# EAGLE design fridge-t10 (EAGLE 6.1)
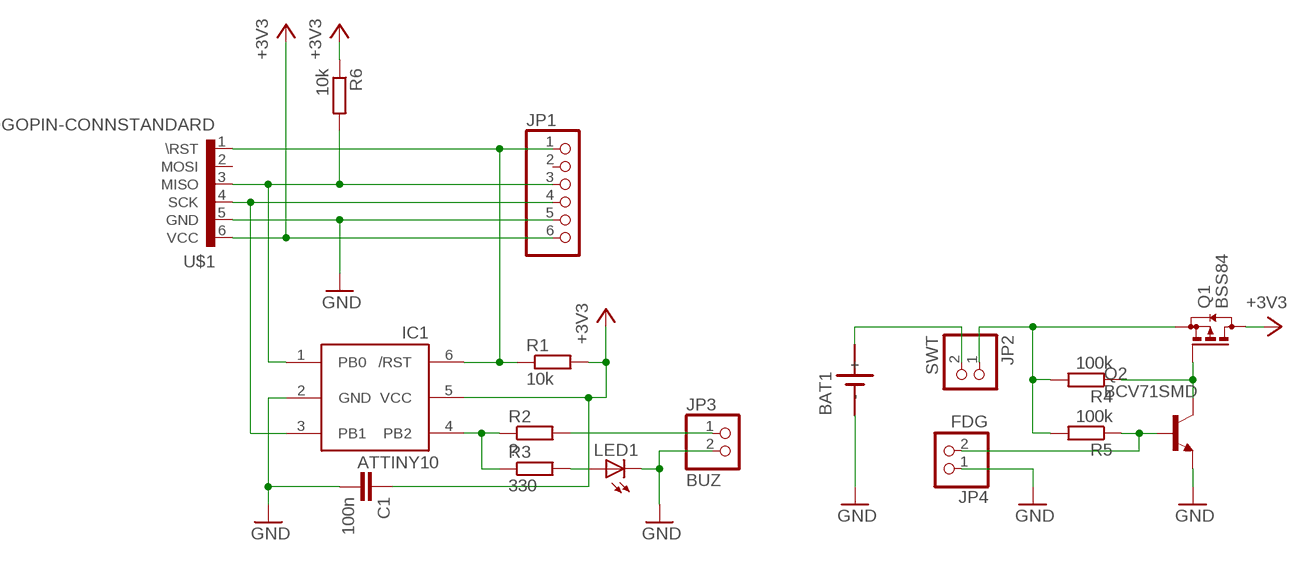
[diagram p0: schematic, sheet 1]

## Parts
BAT1  SN2032  [SN2032]
C1  100n  C-EUC0805K  [C0805K]
IC1  ATTINY10  [SOT23-6]
JP1  PINHD-1X6  [1X06]
JP2  SWT  PINHD-1X2  [1X02]
JP3  BUZ  PINHD-1X2  [1X02]
JP4  FDG  PINHD-1X2  [1X02]
LED1  LEDCHIPLED_0805  [CHIPLED_0805]
Q1  BSS84  [SOT23]
Q2  BCV71SMD  [SOT23-BEC]
R1  10k  R-EU_R0805  [R0805]
R2  ?  R-EU_R0805  [R0805]
R3  330  R-EU_R0805  [R0805]
R4  100k  R-EU_R0805  [R0805]
R5  100k  R-EU_R0805  [R0805]
R6  10k  R-EU_R0805  [R0805]
U$1  POGOPIN-CONNSTANDARD  [POGOPROG-CONN]

## Nets
+3V3: C1.1 IC1.5(VCC) JP1.6 Q1.3(D) R1.2 R6.1 U$1.6(VCC)
GND: BAT1.- C1.2 IC1.2(GND) JP1.5 JP3.2 JP4.1 LED1.C Q2.E U$1.5(GND)
N$1: BAT1.+ JP2.2
N$2: IC1.4(PB2) R2.1 R3.1
N$3: IC1.1(PB0) JP1.3 R6.2 U$1.3(MISO)
N$4: LED1.A R3.2
N$5: IC1.6(/RST) JP1.1 R1.1 U$1.1(\RST)
N$6: JP3.1 R2.2
N$7: JP2.1 Q1.2(S) R4.2 R5.2
N$8: IC1.3(PB1) JP1.4 U$1.4(SCK)
N$9: JP4.2 Q2.B R5.1
N$10: Q1.1(G) Q2.C R4.1
Unconnected: JP1.2 U$1.2(MOSI)

## Library data of the parts
BAT1 = sn2032:SN2032: LI BATTERY
C1 = rcl:C-EU: CAPACITOR, European symbol
IC1 = adafruit:ATTINY10: ATtiny4/5/9/10 8-bit Microcontroller with 512/1024 Bytes In-System Programmable Flash
JP1 = pinhead:PINHD-1X6: PIN HEADER
JP2-JP4 = pinhead:PINHD-1X2: PIN HEADER
LED1 = led:LED: LED OSRAM: - CHIPLED LG R971, LG N971, LY N971, LG Q971, LY Q971, LO R971, LY R971 LH N974, LH R974 LS Q976, LO Q976, LY Q976 LO Q996 - Hyper CHIPLED LW Q18S LB Q993, LB Q99A, LB R99A - SideLED LS A670, LO A670, LY A670, LG A670, LP A670 LB A673, LV A673, LT A673, LW A673 LH A674 LY A675 LS A676, LA A676, LO A676, LY A676, LW A676 LS A679, LY A679, LG A679 - Hyper Micro SIDELED® LS Y876, LA Y876, LO Y876, LY Y876 LT Y87S - SmartLED LW L88C, LW L88S LB L89C, LB L89S, LG L890 LS L89K, LO L89K, LY L89K LS L896, LA L896, LO L896, LY L896 - TOPLED LS T670, LO T670, LY T670, LG T670, LP T670 LSG T670, LSP T670, LSY T670, LOP T670, LYG T670 LG T671, LOG T671, LSG T671 LB T673, LV T673, LT T673, LW T673 LH T674 LS T676, LA T676, LO T676, LY T676, LB T676, LH T676, LSB T676, LW T676 LB T67C, LV T67C, LT T67C, LS T67K, LO T67K, LY T67K, LW E67C LS E67B, LA E67B, LO E67B, LY E67B, LB E67C, LV E67C, LT E67C LW T67C LS T679, LY T679, LG T679 LS T770, LO T770, LY T770, LG T770, LP T770 LB T773, LV T773, LT T773, LW T773 LH T774 LS E675, LA E675, LY E675, LS T675 LS T776, LA T776, LO T776, LY T776, LB T776 LHGB T686 LT T68C, LB T68C - Hyper Mini TOPLED® LB M676 - Mini TOPLED Santana® LG M470 LS M47K, LO M47K, LY M47K Source: http://www.osram.convergy.de LUXEON: - LUMILED® LXK2-PW12-R00, LXK2-PW12-S00, LXK2-PW14-U00, LXK2-PW14-V00 LXK2-PM12-R00, LXK2-PM12-S00, LXK2-PM14-U00 LXK2-PE12-Q00, LXK2-PE12-R00, LXK2-PE12-S00, LXK2-PE14-T00, LXK2-PE14-U00 LXK2-PB12-K00, LXK2-PB12-L00, LXK2-PB12-M00, LXK2-PB14-N00, LXK2-PB14-P00, LXK2-PB14-Q00 LXK2-PR12-L00, LXK2-PR12-M00, LXK2-PR14-Q00, LXK2-PR14-R00 LXK2-PD12-Q00, LXK2-PD12-R00, LXK2-PD12-S00 LXK2-PH12-R00, LXK2-PH12-S00 LXK2-PL12-P00, LXK2-PL12-Q00, LXK2-PL12-R00 Source: www.luxeon.com KINGBRIGHT: KA-3528ASYC Source: www.kingbright.com
Q1 = transistor-small-signal:BSS84: P-CHANNEL MOS FET
Q2 = transistor-npn:BCV71*: NPN Transistor
R1-R6 = rcl:R-EU_: RESISTOR, European symbol
U$1 = Protofusion:POGOPIN-CONN: Protofusion custom pogo pin programming header

## Board
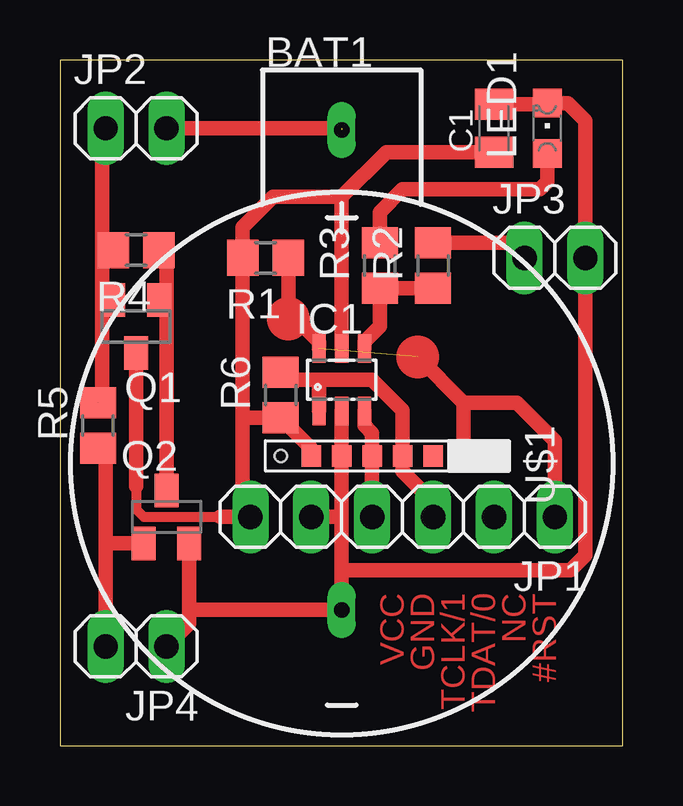
[diagram p1: board, top side]

Size 23.48 x 28.56 mm. Coordinates in mm from the lower left corner, seen from the top.
Outline: 0,0 23.48,0 23.48,28.56 0,28.56 0,0
Copper layers (1*16): Top 0.035mm / dielectric 1.5mm / Bottom 0.035mm
Design rules: minimum track width 10mil, minimum drill 24mil, track to track 12mil, track to pad 12mil, pad to pad 12mil, via to via 12mil, smd to smd 10mil, copper to edge 12mil, drill to drill 12mil, minimum pad ring 10mil, minimum via ring 10mil, stop-mask expansion 4mil, vias tented up to drill 0mil, thermal gap 12mil

### Footprints (pad centres in the part's own frame; a part is rotated, then mirrored left to right if it is on the bottom)
SN2032 = drill 0.65 long: + 0,13.9; - 0,-6.1
C0805K = smd 1.3 x 1.6: 1 -1,0; 2 1,0
SOT23-6 = smd 0.55 x 1.2: 1 -0.95,-1.3; 2 0,-1.3; 3 0.95,-1.3; 4 0.95,1.3; 5 0,1.3; 6 -0.95,1.3
1X06 = drill 1.016 long: 1 -6.35,0; 2 -3.81,0; 3 -1.27,0; 4 1.27,0; 5 3.81,0; 6 6.35,0
1X02 = drill 1.016 long: 1 -1.27,0; 2 1.27,0
CHIPLED_0805 = smd 1.2 x 1.2: A 0,-1.05; C 0,1.05
SOT23 = smd 1 x 1.4: 1 -0.95,-1.1; 2 0.95,-1.1; 3 0,1.1
SOT23-BEC = smd 1 x 1.4: B -0.95,-1.1; C 0,1.1; E 0.95,-1.1
R0805 = smd 1.3 x 1.5: 1 -0.95,0; 2 0.95,0
POGOPROG-CONN = smd 0.889 x 0.813: 1 0,3.81; 2 0,2.54; 3 0,1.27; 4 0,0; 5 0,-1.27; 6 0,-2.54 | hole 0.508: 0,5.08; 0,-3.81

### Placement (x,y rotation side)
BAT1  11.75,11.75 0 top
C1  18.1,25.72 90 top
IC1  11.75,15.24 0 top
JP1  14.29,9.53 180 top
JP2  3.17,25.72 0 top
JP3  20.64,20.32 0 top
JP4  3.17,4.13 180 top
LED1  20.32,25.72 0 top
Q1  3.17,17.46 180 top
Q2  4.45,9.53 0 top
R1  8.57,20.32 180 top
R2  15.56,20 90 top
R3  13.34,20 90 top
R4  3.17,20.64 180 top
R5  1.59,13.34 90 top
R6  9.21,14.61 90 top
U$1  13.02,12.06 270 top

### Tracks (layer width: path | path; a pad name or v marks a point on that pad's centre or on a via)
+3V3
  Top 0.406: 3.17,10.79 3.17,9.84 3.49,9.53 6.67,9.53
  Top 0.61: IC1.5 11.75,22.86 | C1.1 13.61,24.72 11.75,22.86 | 7.62,13.65 7.62,20.64 | 7.62,13.65 7.94,13.65 R6.1 10.48,12.38 U$1.6 | R1.2 7.62,20.64 | 7.62,13.65 7.62,9.84 JP1.6 6.67,9.53 | 11.75,22.86 8.89,22.86 7.62,21.59 7.62,20.64 | Q1.3 3.17,10.79
GND
  Top 0.61: BAT1.- 11.81,5.65 | Q2.E 5.39,5.71 | 5.39,5.71 5.39,5.08 JP4.1 | C1.2 20.27,26.72 LED1.C 21.18,26.77 21.91,26.04 JP3.2 21.91,7.94 21.27,7.3 11.75,7.3 | IC1.2 U$1.5 11.75,9.53 | 11.75,9.53 11.75,7.3 | 11.75,7.3 BAT1.- | BAT1.- 5.46,5.65 5.39,5.71 | JP1.5 11.75,9.53
N$1  (1 unrouted)
  Top 0.61: JP2.2 11.75,25.72
N$2
  Top 0.61: IC1.4 12.7,16.82 13.34,17.46 R3.1 R2.1
N$3
  Top 0.61: 9.21,15.24 | R6.2 9.21,15.24 | 9.21,15.24 10.79,15.24 | 10.79,15.24 13.02,15.24 14.29,13.97 U$1.3 14.29,11.43 15.56,10.16 JP1.3 | IC1.1 10.8,15.24 10.79,15.24
N$4
  Top 0.61: LED1.A 20.32,23.5 20,23.18 14.29,23.18 13.34,22.23 R3.2
N$5  (1 unrouted)
  Top 0.61: 16.83,14.29 14.92,16.19 | IC1.6 10.8,16.82 9.53,18.1 R1.1 | U$1.1 16.83,14.29 | 16.83,14.29 19.05,14.29 20.64,12.7 JP1.1
N$6
  Top 0.61: R2.2 18.73,20.95 JP3.1
N$7  (1 unrouted)
  Top 0.61: R5.2 1.75,14.45 1.75,18.41 | 1.75,18.41 1.75,20.64 | 1.75,20.64 1.75,25.57 JP2.1 | Q1.2 1.9,18.56 1.75,18.41 | R4.2 1.75,20.64
N$8
  Top 0.61: IC1.3 12.7,13.34 13.02,13.02 U$1.4 JP1.4
N$9
  Top 0.61: R5.1 1.9,12.38 1.91,12.38 1.91,8.26 | 1.91,8.26 JP4.2 | Q2.B 2.08,8.43 1.91,8.26
N$10
  Top 0.61: Q2.C 4.45,18.73 | 4.45,18.73 4.45,20.95 4.44,20.95 R4.1 | Q1.1 4.28,18.56 4.45,18.73
(copper drawn outside any net)
  shapes: Top circle x2

### Text on the board
Top: VCC | GND | TCLK/1 | TDAT/0 | NC | #RST